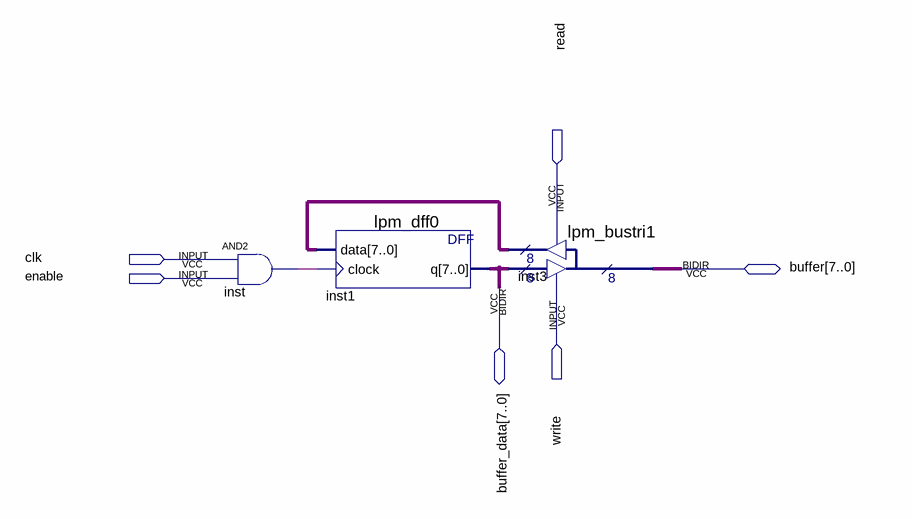
[diagram p0: schematic sheet]
// Quartus schematic BUFFER.bdf as structural Verilog: 3 symbols, 6 pins
module BUFFER (
  input  read,
  input  clk,
  input  enable,
  input  write,
  inout  [7:0] buffer,
  inout  [7:0] buffer_data
);

  wire inst_out;
  wire [7:0] inst3_result;

  and inst (inst_out, clk, enable);
  lpm_dff0 inst1 (.data(inst3_result), .clock(inst_out), .q(buffer_data));
  lpm_bustri1 inst3 (.enabledt(write), .data(buffer_data), .enabletr(read), .result(inst3_result), .tridata(buffer));
endmodule
